# EAGLE design stm32g071c_bb (EAGLE 7.3.0)
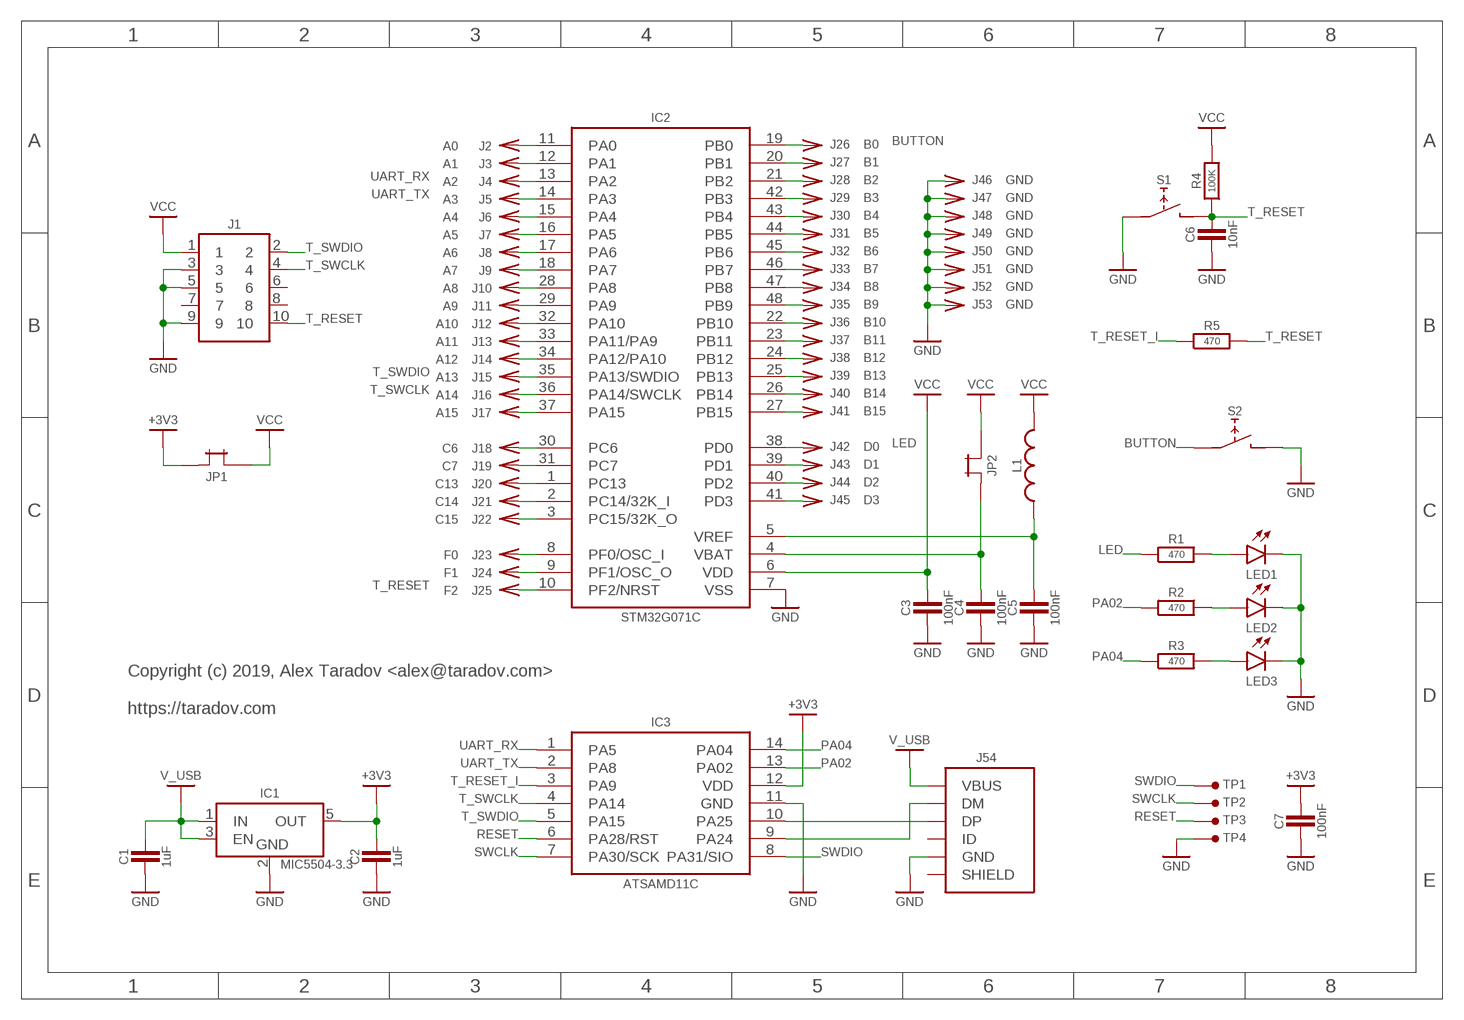
[diagram p0: schematic, sheet 1]

## Parts
C1  1uF  C-0603  [SMD0603]
C2  1uF  C-0603  [SMD0603]
C3  100nF  C-0603  [SMD0603]
C4  100nF  C-0603  [SMD0603]
C5  100nF  C-0603  [SMD0603]
C6  10nF  C-0603  [SMD0603]
C7  100nF  C-0603  [SMD0603]
IC1  MIC5504-3.3  MIC5504-SOT23-5  [SOT23-5]
IC2  STM32G071C  [TQFP-48-0.5MM]
IC3  ATSAMD11C  [SO-14]
J1  HEADER-5X2-TH-1.27  [HEADER-5X2-1.27MM]
J2  A0  CONN-SINGLE-TH  [PIN-TH]
J3  A1  CONN-SINGLE-TH  [PIN-TH]
J4  A2  CONN-SINGLE-TH  [PIN-TH]
J5  A3  CONN-SINGLE-TH  [PIN-TH]
J6  A4  CONN-SINGLE-TH  [PIN-TH]
J7  A5  CONN-SINGLE-TH  [PIN-TH]
J8  A6  CONN-SINGLE-TH  [PIN-TH]
J9  A7  CONN-SINGLE-TH  [PIN-TH]
J10  A8  CONN-SINGLE-TH  [PIN-TH]
J11  A9  CONN-SINGLE-TH  [PIN-TH]
J12  A10  CONN-SINGLE-TH  [PIN-TH]
J13  A11  CONN-SINGLE-TH  [PIN-TH]
J14  A12  CONN-SINGLE-TH  [PIN-TH]
J15  A13  CONN-SINGLE-TH  [PIN-TH]
J16  A14  CONN-SINGLE-TH  [PIN-TH]
J17  A15  CONN-SINGLE-TH  [PIN-TH]
J18  C6  CONN-SINGLE-TH  [PIN-TH]
J19  C7  CONN-SINGLE-TH  [PIN-TH]
J20  C13  CONN-SINGLE-TH  [PIN-TH]
J21  C14  CONN-SINGLE-TH  [PIN-TH]
J22  C15  CONN-SINGLE-TH  [PIN-TH]
J23  F0  CONN-SINGLE-TH  [PIN-TH]
J24  F1  CONN-SINGLE-TH  [PIN-TH]
J25  F2  CONN-SINGLE-TH  [PIN-TH]
J26  B0  CONN-SINGLE-TH  [PIN-TH]
J27  B1  CONN-SINGLE-TH  [PIN-TH]
J28  B2  CONN-SINGLE-TH  [PIN-TH]
J29  B3  CONN-SINGLE-TH  [PIN-TH]
J30  B4  CONN-SINGLE-TH  [PIN-TH]
J31  B5  CONN-SINGLE-TH  [PIN-TH]
J32  B6  CONN-SINGLE-TH  [PIN-TH]
J33  B7  CONN-SINGLE-TH  [PIN-TH]
J34  B8  CONN-SINGLE-TH  [PIN-TH]
J35  B9  CONN-SINGLE-TH  [PIN-TH]
J36  B10  CONN-SINGLE-TH  [PIN-TH]
J37  B11  CONN-SINGLE-TH  [PIN-TH]
J38  B12  CONN-SINGLE-TH  [PIN-TH]
J39  B13  CONN-SINGLE-TH  [PIN-TH]
J40  B14  CONN-SINGLE-TH  [PIN-TH]
J41  B15  CONN-SINGLE-TH  [PIN-TH]
J42  D0  CONN-SINGLE-TH  [PIN-TH]
J43  D1  CONN-SINGLE-TH  [PIN-TH]
J44  D2  CONN-SINGLE-TH  [PIN-TH]
J45  D3  CONN-SINGLE-TH  [PIN-TH]
J46  GND  CONN-SINGLE-TH  [PIN-TH]
J47  GND  CONN-SINGLE-TH  [PIN-TH]
J48  GND  CONN-SINGLE-TH  [PIN-TH]
J49  GND  CONN-SINGLE-TH  [PIN-TH]
J50  GND  CONN-SINGLE-TH  [PIN-TH]
J51  GND  CONN-SINGLE-TH  [PIN-TH]
J52  GND  CONN-SINGLE-TH  [PIN-TH]
J53  GND  CONN-SINGLE-TH  [PIN-TH]
J54  USB-B-MICRO-SMT  [USB-B-MICRO-SMT-SHELL-TH]
JP1  JUMPER-TH-TH  [JUMPER-TH]
JP2  JUMPER-TH-TH  [JUMPER-TH]
L1  L-0603  [SMD0603]
LED1  LED_SMDLED_0603  [SMD0603]
LED2  LED_SMDLED_0603  [SMD0603]
LED3  LED_SMDLED_0603  [SMD0603]
R1  470  R-0603  [SMD0603]
R2  470  R-0603  [SMD0603]
R3  470  R-0603  [SMD0603]
R4  100K  R-0603  [SMD0603]
R5  470  R-0603  [SMD0603]
S1  TACT_SWITCH_6MM-SMD-HALF  [TACT-SMD-6MM-HALF]
S2  TACT_SWITCH_6MM-SMD-HALF  [TACT-SMD-6MM-HALF]
TP1  SIO  TEST-POINT-1.27MM  [TP-1.27MM]
TP2  TEST-POINT-1.27MM  [TP-1.27MM]
TP3  TEST-POINT-1.27MM  [TP-1.27MM]
TP4  TEST-POINT-1.27MM  [TP-1.27MM]

## Nets
+3V3: C2.2 C7.2 IC1.5(OUT) IC3.12(VDD) JP1.1
BUTTON: IC2.19(PB0) J26.1 S2.1
GND: C1.1 C2.1 C3.1 C4.1 C5.1 C6.1 C7.1 IC1.2(GND) IC2.7(VSS) IC3.11(GND) J1.3 J1.5 J1.9 J46.1 J47.1 J48.1 J49.1 J50.1 J51.1 J52.1 J53.1 J54.5(GND) LED1.2(C) LED2.2(C) LED3.2(C) S1.1 S2.2 TP4.1
LED: IC2.38(PD0) J42.1 R1.1
N$1: IC3.9(PA24) J54.2(DM)
N$2: IC3.10(PA25) J54.3(DP)
N$4: LED2.1(A) R2.2
N$5: IC2.20(PB1) J27.1
N$6: LED3.1(A) R3.2
N$7: IC2.21(PB2) J28.1
N$9: IC2.42(PB3) J29.1
N$10: IC2.43(PB4) J30.1
N$12: IC2.45(PB6) J32.1
N$13: IC2.47(PB8) J34.1
N$14: IC2.48(PB9) J35.1
N$15: IC2.22(PB10) J36.1
N$16: IC2.23(PB11) J37.1
N$17: IC2.24(PB12) J38.1
N$18: IC2.25(PB13) J39.1
N$19: IC2.26(PB14) J40.1
N$20: IC2.27(PB15) J41.1
N$21: IC2.44(PB5) J31.1
N$22: IC2.46(PB7) J33.1
N$23: IC2.11(PA0) J2.1
N$24: IC2.12(PA1) J3.1
N$27: IC2.15(PA4) J6.1
N$28: IC2.16(PA5) J7.1
N$29: IC2.17(PA6) J8.1
N$30: IC2.18(PA7) J9.1
N$31: IC2.28(PA8) J10.1
N$32: IC2.29(PA9) J11.1
N$33: IC2.32(PA10) J12.1
N$34: IC2.33(PA11/PA9) J13.1
N$35: IC2.34(PA12/PA10) J14.1
N$38: IC2.37(PA15) J17.1
N$39: IC2.39(PD1) J43.1
N$40: IC2.41(PD3) J45.1
N$42: IC2.40(PD2) J44.1
N$43: IC2.30(PC6) J18.1
N$44: IC2.1(PC13) J20.1
N$45: IC2.2(PC14/32K_I) J21.1
N$46: IC2.3(PC15/32K_O) J22.1
N$47: IC2.9(PF1/OSC_O) J24.1
N$49: IC2.8(PF0/OSC_I) J23.1
N$50: IC2.31(PC7) J19.1
N$51: C5.2 IC2.5(VREF) L1.1
N$53: C4.2 IC2.4(VBAT) JP2.1
N$54: LED1.1(A) R1.2
PA02: IC3.13(PA02) R2.1
PA04: IC3.14(PA04) R3.1
RESET: IC3.6(PA28/RST) TP3.1
SWCLK: IC3.7(PA30/SCK) TP2.1
SWDIO: IC3.8(PA31/SIO) TP1.1
T_RESET: C6.2 IC2.10(PF2/NRST) J1.10 J25.1 R4.1 R5.2 S1.2
T_RESET_I: IC3.3(PA9) R5.1
T_SWCLK: IC2.36(PA14/SWCLK) IC3.4(PA14) J1.4 J16.1
T_SWDIO: IC2.35(PA13/SWDIO) IC3.5(PA15) J1.2 J15.1
UART_RX: IC2.13(PA2) IC3.1(PA5) J4.1
UART_TX: IC2.14(PA3) IC3.2(PA8) J5.1
V_USB: C1.2 IC1.1(IN) IC1.3(EN) J54.1(VBUS)
VCC: C3.2 IC2.6(VDD) J1.1 JP1.2 JP2.2 L1.2 R4.2
Unconnected: J1.6 J1.7 J1.8 J54.4(ID) J54.M1(SHIELD) J54.M2(SHIELD) J54.M3(SHIELD) J54.M4(SHIELD)

## Notes on the sheet
- Copyright (c) 2019, Alex Taradov <alex@taradov.com>
  
  https://taradov.com

## Library data of the parts
C1-C7 = ataradov_rlc:C
IC1 = ataradov_vreg:MIC5504: LM1117 voltage regulator
IC2 = ataradov_mcu:STM32G071C
IC3 = ataradov_mcu:ATSAMD11C
J1 = ataradov_conn:HEADER-5X2
J2-J53 = ataradov_conn:CONN-SINGLE
J54 = ataradov_conn:USB-B-MICRO
JP1 JP2 = ataradov_conn:JUMPER-TH
L1 = ataradov_rlc:L
LED1-LED3 = ataradov_led:LED_SMD: SMD_LED
R1-R5 = ataradov_rlc:R
S1 S2 = ataradov_switch:TACT_SWITCH_6MM
TP1-TP4 = ataradov_misc:TEST-POINT: Test Point

## Board
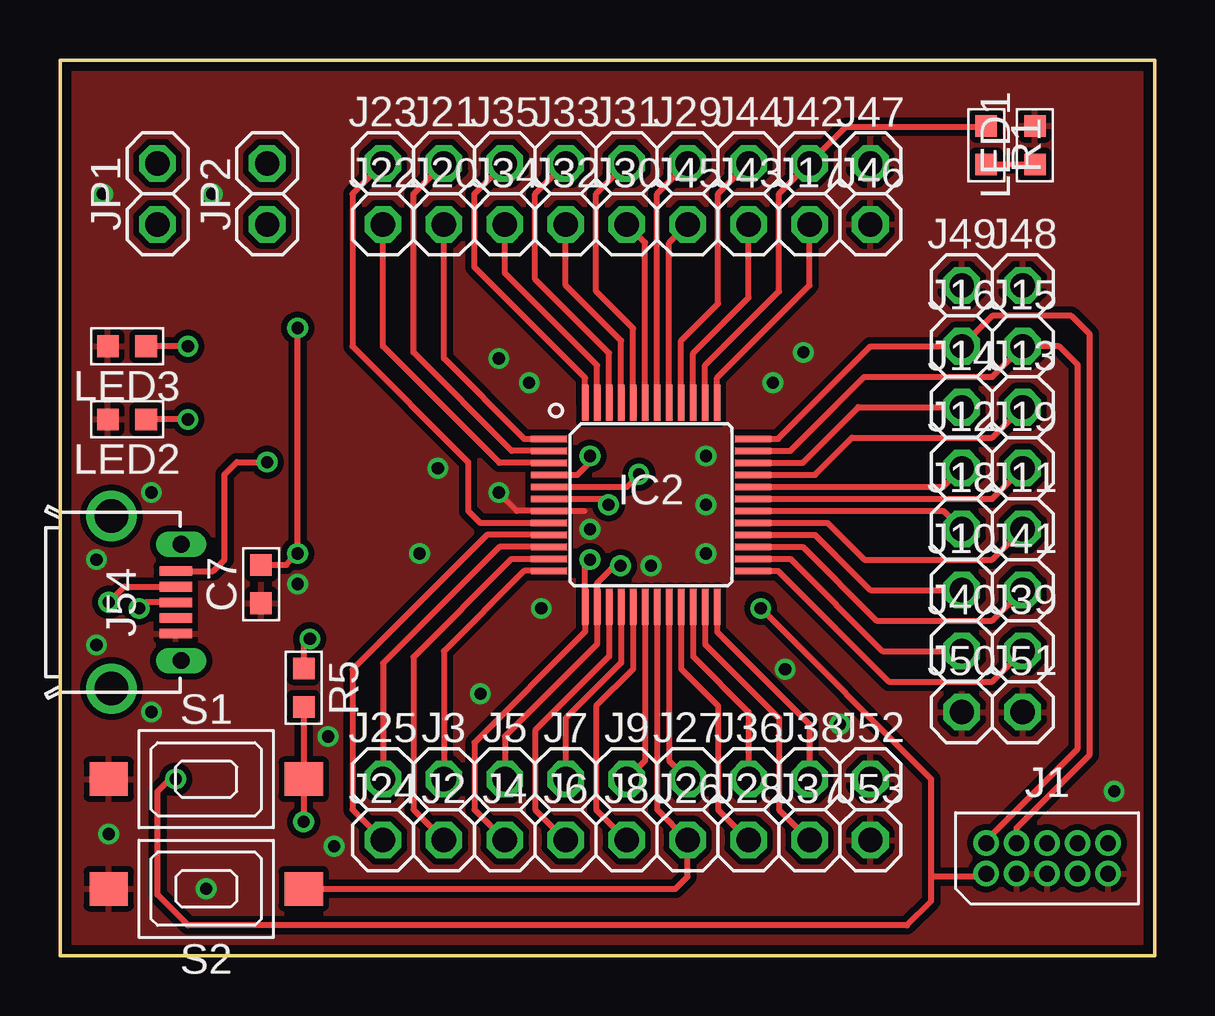
[diagram p1: board, top side]
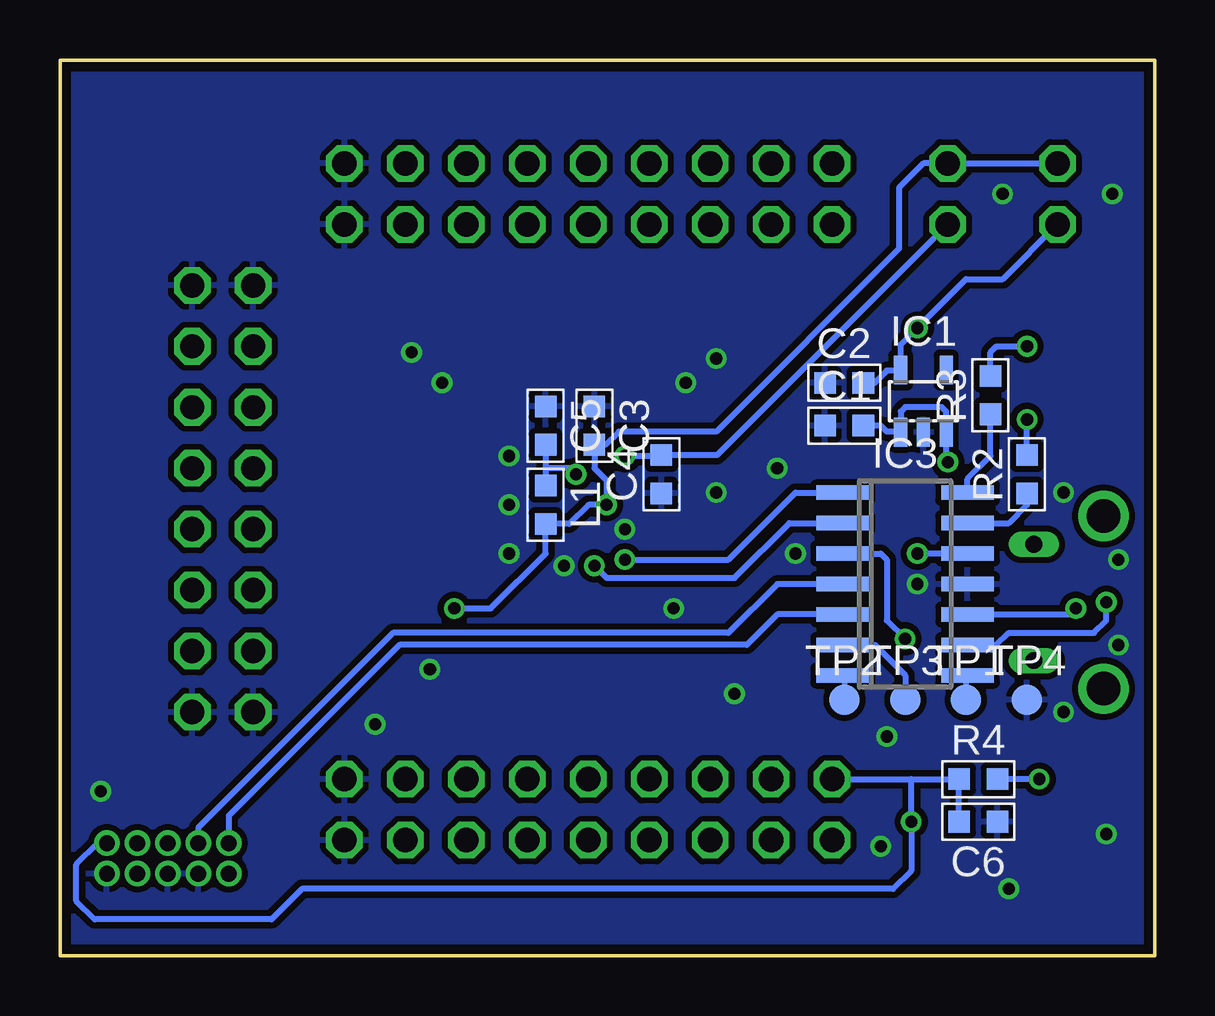
[diagram p2: board, bottom side, seen from below]

Size 45.64 x 37.33 mm. Coordinates in mm from the lower left corner, seen from the top.
Outline: 0,0 45.64,0 45.64,37.33 0,37.33 0,0
Copper layers (1*16): Top 0.0356mm / dielectric 1.5011mm / Bottom 0.0356mm
Design rules "std-tented": minimum track width 6mil, minimum drill 13mil, track to track 6mil, track to pad 6mil, pad to pad 6mil, via to via 6mil, smd to smd 6mil, copper to edge 15mil, drill to drill 6mil, minimum pad ring 7mil, minimum via ring 7mil, stop-mask expansion 3mil, vias tented up to drill 25mil, thermal gap 10mil

### Footprints (pad centres in the part's own frame; a part is rotated, then mirrored left to right if it is on the bottom)
SMD0603 = smd 0.9 x 0.9: 1 -0.8,0; 2 0.8,0
SOT23-5 = smd 0.55 x 1.2: 1 -0.95,-1.3; 2 0,-1.3; 3 0.95,-1.3; 4 0.95,1.3; 5 -0.95,1.3
TQFP-48-0.5MM = smd 1.5 x 0.27: 1 -4.25,2.75; 2 -4.25,2.25; 3 -4.25,1.75; 4 -4.25,1.25; 5 -4.25,0.75; 6 -4.25,0.25; 7 -4.25,-0.25; 8 -4.25,-0.75; 9 -4.25,-1.25; 10 -4.25,-1.75; 11 -4.25,-2.25; 12 -4.25,-2.75; 25 4.25,-2.75; 26 4.25,-2.25; 27 4.25,-1.75; 28 4.25,-1.25; 29 4.25,-0.75; 30 4.25,-0.25; 31 4.25,0.25; 32 4.25,0.75; 33 4.25,1.25; 34 4.25,1.75; 35 4.25,2.25; 36 4.25,2.75 | smd 0.27 x 1.5: 13 -2.75,-4.25; 14 -2.25,-4.25; 15 -1.75,-4.25; 16 -1.25,-4.25; 17 -0.75,-4.25; 18 -0.25,-4.25; 19 0.25,-4.25; 20 0.75,-4.25; 21 1.25,-4.25; 22 1.75,-4.25; 23 2.25,-4.25; 24 2.75,-4.25; 37 2.75,4.25; 38 2.25,4.25; 39 1.75,4.25; 40 1.25,4.25; 41 0.75,4.25; 42 0.25,4.25; 43 -0.25,4.25; 44 -0.75,4.25; 45 -1.25,4.25; 46 -1.75,4.25; 47 -2.25,4.25; 48 -2.75,4.25
SO-14 = smd 0.6 x 2.2: 1 -3.81,-2.6; 2 -2.54,-2.6; 3 -1.27,-2.6; 4 0,-2.6; 5 1.27,-2.6; 6 2.54,-2.6; 7 3.81,-2.6; 8 3.81,2.6; 9 2.54,2.6; 10 1.27,2.6; 11 0,2.6; 12 -1.27,2.6; 13 -2.54,2.6; 14 -3.81,2.6
HEADER-5X2-1.27MM = drill 0.66 pad 1.067: 1 -2.54,-0.635; 2 -2.54,0.635; 3 -1.27,-0.635; 4 -1.27,0.635; 5 0,-0.635; 6 0,0.635; 7 1.27,-0.635; 8 1.27,0.635; 9 2.54,-0.635; 10 2.54,0.635
PIN-TH = drill 1.016 octagon: 1 0,0
USB-B-MICRO-SMT-SHELL-TH = smd 1.35 x 0.4: 1 4.825,1.3; 2 4.825,0.65; 3 4.825,0; 4 4.825,-0.65; 5 4.825,-1.3 | drill 1.397: M1 2.15,-3.6; M2 2.15,3.6 | drill 0.7 long: M3 5.05,2.425; M4 5.05,-2.425
JUMPER-TH = drill 1.016 octagon: 1 -1.27,0; 2 1.27,0
TACT-SMD-6MM-HALF = smd 1.6 x 1.4: 1 -4.064,0; 2 4.064,0
TP-1.27MM = smd 1.27 x 1.27: 1 0,0

### Placement (x,y rotation side)
C1  12.95,22.1 0 bottom
C2  12.95,23.88 0 bottom
C3  23.37,22.1 270 bottom
C4  20.57,20.07 90 bottom
C5  25.4,22.1 270 bottom
C6  7.37,5.59 180 bottom
C7  8.38,15.49 90 top
IC1  9.65,23.11 0 bottom
IC2  24.64,18.8 0 top
IC3  10.41,15.49 270 bottom
J1  41.15,4.06 0 top
J2  16,4.83 0 top
J3  16,7.37 0 top
J4  18.54,4.83 0 top
J5  18.54,7.37 0 top
J6  21.08,4.83 0 top
J7  21.08,7.37 0 top
J8  23.62,4.83 0 top
J9  23.62,7.37 0 top
J10  37.59,15.24 0 top
J11  40.13,17.78 0 top
J12  37.59,20.32 0 top
J13  40.13,22.86 0 top
J14  37.59,22.86 0 top
J15  40.13,25.4 0 top
J16  37.59,25.4 0 top
J17  31.24,30.48 0 top
J18  37.59,17.78 0 top
J19  40.13,20.32 0 top
J20  16,30.48 0 top
J21  16,33.02 0 top
J22  13.46,30.48 0 top
J23  13.46,33.02 0 top
J24  13.46,4.83 0 top
J25  13.46,7.37 0 top
J26  26.16,4.83 0 top
J27  26.16,7.37 0 top
J28  28.7,4.83 0 top
J29  26.16,33.02 0 top
J30  23.62,30.48 0 top
J31  23.62,33.02 0 top
J32  21.08,30.48 0 top
J33  21.08,33.02 0 top
J34  18.54,30.48 0 top
J35  18.54,33.02 0 top
J36  28.7,7.37 0 top
J37  31.24,4.83 0 top
J38  31.24,7.37 0 top
J39  40.13,12.7 0 top
J40  37.59,12.7 0 top
J41  40.13,15.24 0 top
J42  31.24,33.02 0 top
J43  28.7,30.48 0 top
J44  28.7,33.02 0 top
J45  26.16,30.48 0 top
J46  33.78,30.48 0 top
J47  33.78,33.02 0 top
J48  40.13,27.94 0 top
J49  37.59,27.94 0 top
J50  37.59,10.16 0 top
J51  40.13,10.16 0 top
J52  33.78,7.37 0 top
J53  33.78,4.83 0 top
J54  0,14.73 0 top
JP1  4.06,31.75 90 top
JP2  8.64,31.75 90 top
L1  25.4,18.8 270 bottom
LED1  40.64,33.78 90 top
LED2  2.79,22.35 180 top
LED3  2.79,25.4 180 top
R1  38.61,33.78 270 top
R2  5.33,20.07 90 bottom
R3  6.86,23.37 90 bottom
R4  7.37,7.37 0 bottom
R5  10.16,11.18 270 top
S1  6.1,7.37 0 top
S2  6.1,2.79 180 top
TP1  7.87,10.67 0 bottom
TP2  12.95,10.67 0 bottom
TP3  10.41,10.67 0 bottom
TP4  5.33,10.67 0 bottom

### Tracks (layer width: path | path; a pad name or v marks a point on that pad's centre or on a via)
+3V3  (via drill 0.51 pad 0.51)
  Top 0.254: v9.91,26.16 v9.91,16.76 9.44,16.29 C7.2
  Bottom 0.254: C2.2 11.68,23.88 11.18,24.38 10.63,24.38 IC1.5 10.6,25.47 v9.91,26.16 7.87,28.19 6.35,28.19 JP1.1 | IC3.12 v9.91,16.76
BUTTON
  Top 0.254: IC2.19 24.89,6.1 J26.1 26.16,3.3 25.65,2.79 S2.1
GND  (via drill 0.51 pad 0.25)
  Top 0.254: IC2.7 | IC2.7 19.05,18.54 v18.29,19.3 | IC2.7 21.84,18.54
  other vias: 1.52,16.51 1.52,12.95 3.81,19.3 3.81,10.16 9.91,15.49 29.72,23.88 30.99,25.15 30.23,11.94 32.51,9.65 19.56,23.88 18.29,24.89 20.07,14.48 17.53,10.92 15.75,20.32 22.1,17.78 26.92,20.83 26.92,16.76 26.92,18.8 24.64,16.26 14.99,16.76 43.94,6.86 11.43,4.57 11.18,9.14 6.1,2.79 2.03,5.08 6.35,31.75 1.78,31.75
  pour Bottom (isolate 0.254): 0,37.34 45.72,37.34 45.72,0 0,0
  pour Top (isolate 0.254): 0,37.34 45.72,37.34 45.72,0 0,0
LED
  Top 0.254: IC2.38 26.89,24.6 29.97,27.69 29.97,31.75 J42.1 32.77,34.54 38.57,34.54 R1.1
N$1  (via drill 0.51 pad 0.25)
  Top 0.254: v2.03,14.73 2.68,15.38 J54.2
  Bottom 0.254: IC3.9 6.6,12.95 6.1,13.46 2.54,13.46 2.03,13.97 v2.03,14.73
N$2  (via drill 0.51 pad 0.25)
  Top 0.254: J54.3 3.56,14.73 v3.3,14.48
  Bottom 0.254: IC3.10 3.56,14.22 v3.3,14.48
N$4  (via drill 0.51 pad 0.51)
  Top 0.254: v5.33,22.35 LED2.1
  Bottom 0.254: R2.2 v5.33,22.35
N$5
  Top 0.254: IC2.20 25.39,8.14 J27.1
N$6  (via drill 0.51 pad 0.51)
  Top 0.254: v5.33,25.4 LED3.1
  Bottom 0.254: R3.2 6.86,25.15 6.6,25.4 v5.33,25.4
N$7
  Top 0.254: IC2.21 25.89,11.96 27.43,10.41 27.43,6.1 J28.1
N$9
  Top 0.254: IC2.42 24.89,31.75 J29.1
N$10
  Top 0.254: IC2.43 24.39,29.71 J30.1
N$12
  Top 0.254: IC2.45 23.39,25.63 21.08,27.94 J32.1
N$13
  Top 0.254: IC2.47 22.39,24.6 18.54,28.45 J34.1
N$14
  Top 0.254: IC2.48 21.89,24.09 17.27,28.7 17.27,31.75 J35.1
N$15
  Top 0.254: IC2.22 26.39,12.47 28.7,10.16 J36.1
N$16
  Top 0.254: IC2.23 26.89,12.99 29.97,9.91 29.97,6.1 J37.1
N$17
  Top 0.254: IC2.24 27.39,13.51 31.24,9.65 J38.1
N$18
  Top 0.254: IC2.25 29.93,16.05 34.54,11.43 38.86,11.43 J39.1
N$19
  Top 0.254: IC2.26 30.44,16.55 34.29,12.7 J40.1
N$20
  Top 0.254: IC2.27 30.96,17.05 34.04,13.97 38.86,13.97 J41.1
N$21
  Top 0.254: IC2.44 23.89,26.15 22.35,27.69 22.35,31.75 J31.1
N$22
  Top 0.254: IC2.46 22.89,25.12 19.81,28.19 19.81,31.75 J33.1
N$23
  Top 0.254: J2.1 14.73,6.1 14.73,12.45 18.83,16.55 IC2.11
N$24
  Top 0.254: J3.1 16,12.7 19.35,16.05 IC2.12
N$27
  Top 0.254: IC2.15 22.89,12.47 19.81,9.4 19.81,6.1 J6.1
N$28
  Top 0.254: IC2.16 23.39,12.21 21.08,9.91 J7.1
N$29
  Top 0.254: IC2.17 23.89,11.95 22.35,10.41 22.35,6.1 J8.1
N$30
  Top 0.254: IC2.18 24.39,8.13 J9.1
N$31
  Top 0.254: IC2.28 31.48,17.55 33.78,15.24 J10.1
N$32
  Top 0.254: IC2.29 31.99,18.05 33.53,16.51 38.86,16.51 J11.1
N$33
  Top 0.254: IC2.32 36.82,19.55 J12.1
N$34
  Top 0.254: IC2.33 31.48,20.05 33.02,21.59 38.86,21.59 J13.1
N$35
  Top 0.254: IC2.34 30.96,20.55 33.27,22.86 J14.1
N$38
  Top 0.254: IC2.37 27.39,24.09 31.24,27.94 J17.1
N$39
  Top 0.254: IC2.39 26.39,25.12 28.7,27.43 J43.1
N$40
  Top 0.254: IC2.41 25.39,29.71 J45.1
N$42
  Top 0.254: IC2.40 25.89,25.63 27.43,27.18 27.43,31.75 J44.1
N$43
  Top 0.254: IC2.30 36.83,18.55 J18.1
N$44
  Top 0.254: J20.1 16,24.89 19.35,21.55 IC2.1
N$45
  Top 0.254: IC2.2 18.83,21.05 14.73,25.15 14.73,31.75 J21.1
N$46
  Top 0.254: IC2.3 18.32,20.55 13.46,25.4 J22.1
N$47
  Top 0.254: IC2.9 17.8,17.55 12.19,11.94 12.19,6.1 J24.1
N$49
  Top 0.254: J23.1 12.19,31.75 12.19,25.4 17.02,20.57 17.02,18.54 17.51,18.05 IC2.8
N$50
  Top 0.254: IC2.31 38.86,19.05 J19.1
N$51  (via drill 0.51 pad 0.51)
  Top 0.254: IC2.5 23.63,19.55 v24.13,20.07
  Bottom 0.254: C5.2 25.4,20.32 | 25.4,20.32 L1.1 | v24.13,20.07 24.38,20.32 25.4,20.32
N$53  (via drill 0.51 pad 0.51)
  Top 0.254: IC2.4 21.57,20.05 22.1,20.57 v22.1,20.83
  Bottom 0.254: JP2.1 18.25,20.87 C4.2 20.61,20.83 v22.1,20.83
N$54
  Top 0.254: R1.2 LED1.1
PA02
  Bottom 0.254: IC3.13 6.1,18.03 5.33,18.8 R2.1
PA04
  Bottom 0.254: IC3.14 7.81,19.87 6.86,20.83 R3.1
RESET
  Bottom 0.254: IC3.6 11.68,12.95 10.41,11.68 TP3.1
SWCLK
  Bottom 0.254: IC3.7 12.95,11.62 TP2.1
SWDIO
  Bottom 0.254: IC3.8 7.87,11.62 TP1.1
T_RESET  (via drill 0.51 pad 0.51)
  Top 0.254: IC2.10 18.32,17.05 13.46,12.19 J25.1 | v10.16,5.59 S1.2 R5.2
  Bottom 0.254: C6.2 R4.1 S1.2 | J25.1 S1.2 | S1.2 v10.16,5.59 10.16,3.56 10.92,2.79 35.56,2.79 36.83,1.52 44.2,1.52 44.96,2.29 44.96,3.81 44.07,4.7 J1.10
T_RESET_I  (via drill 0.51 pad 0.51)
  Top 0.254: v10.41,13.21 10.16,12.95 R5.1
  Bottom 0.254: IC3.3 11.43,16.76 11.18,16.51 11.18,13.97 v10.41,13.21
T_SWCLK
  Top 0.254: IC2.36 29.93,21.55 33.78,25.4 J16.1 38.86,26.67 42.16,26.67 42.93,25.91 42.93,8.38 39.88,5.33 J1.4
  Bottom 0.254: IC3.4 15.75,15.49 17.78,13.46 31.75,13.46 39.88,5.33 J1.4
T_SWDIO
  Top 0.254: IC2.35 30.44,21.05 33.53,24.13 38.86,24.13 J15.1 41.66,25.4 42.42,24.64 42.42,8.64 38.61,4.83 J1.2
  Bottom 0.254: IC3.5 15.75,14.22 17.02,12.95 31.5,12.95 38.61,5.84 J1.2
UART_RX  (via drill 0.51 pad 0.51)
  Top 0.254: J4.1 17.27,6.1 17.27,8.89 21.89,13.51 IC2.13 21.89,16.3 v22.1,16.51
  Bottom 0.254: v22.1,16.51 17.78,16.51 14.99,19.3 IC3.1
UART_TX  (via drill 0.51 pad 0.51)
  Top 0.254: J5.1 18.54,9.14 22.39,12.99 IC2.14 22.39,15.53 23.11,16.26 v23.37,16.26
  Bottom 0.254: v23.37,16.26 22.86,15.75 17.53,15.75 15.24,18.03 IC3.2
V_USB  (via drill 0.51 pad 0.51)
  Top 0.254: J54.1 6.38,16.03 6.86,16.51 6.86,20.07 7.37,20.57 v8.64,20.57
  Bottom 0.254: C1.2 11.43,22.1 11.18,21.84 10.63,21.84 IC1.1 10.6,22.67 10.41,22.86 8.89,22.86 8.7,22.67 IC1.3 8.7,20.64 v8.64,20.57
VCC  (via drill 0.51 pad 0.51)
  Top 0.254: IC2.6 22.61,19.05 v22.86,18.8 | 36.32,3.3 36.32,2.29 35.31,1.27 5.33,1.27 4.06,2.54 4.06,6.86 4.57,7.37 v4.83,7.37 | 36.32,3.3 36.32,7.37 v29.21,14.48 | J1.1 38.48,3.3 36.32,3.3
  Bottom 0.254: JP1.2 JP2.2 9.65,33.02 10.67,32 10.67,29.46 18.29,21.84 22.35,21.84 22.9,21.3 C3.2 23.37,20.32 22.86,19.81 v22.86,18.8 23.62,18.8 24.42,18 L1.2 25.4,16.76 27.69,14.48 v29.21,14.48 | v4.83,7.37 R4.2

### Text on the board
tValues: VCC | VCC | AT | 4/13/19 | VIN | VBAT | RESET
bValues: www.taradov.com